# Altium schematic sheet SDCard.SchDoc
size A4; SheetNumber: 9; SheetTotal: 22
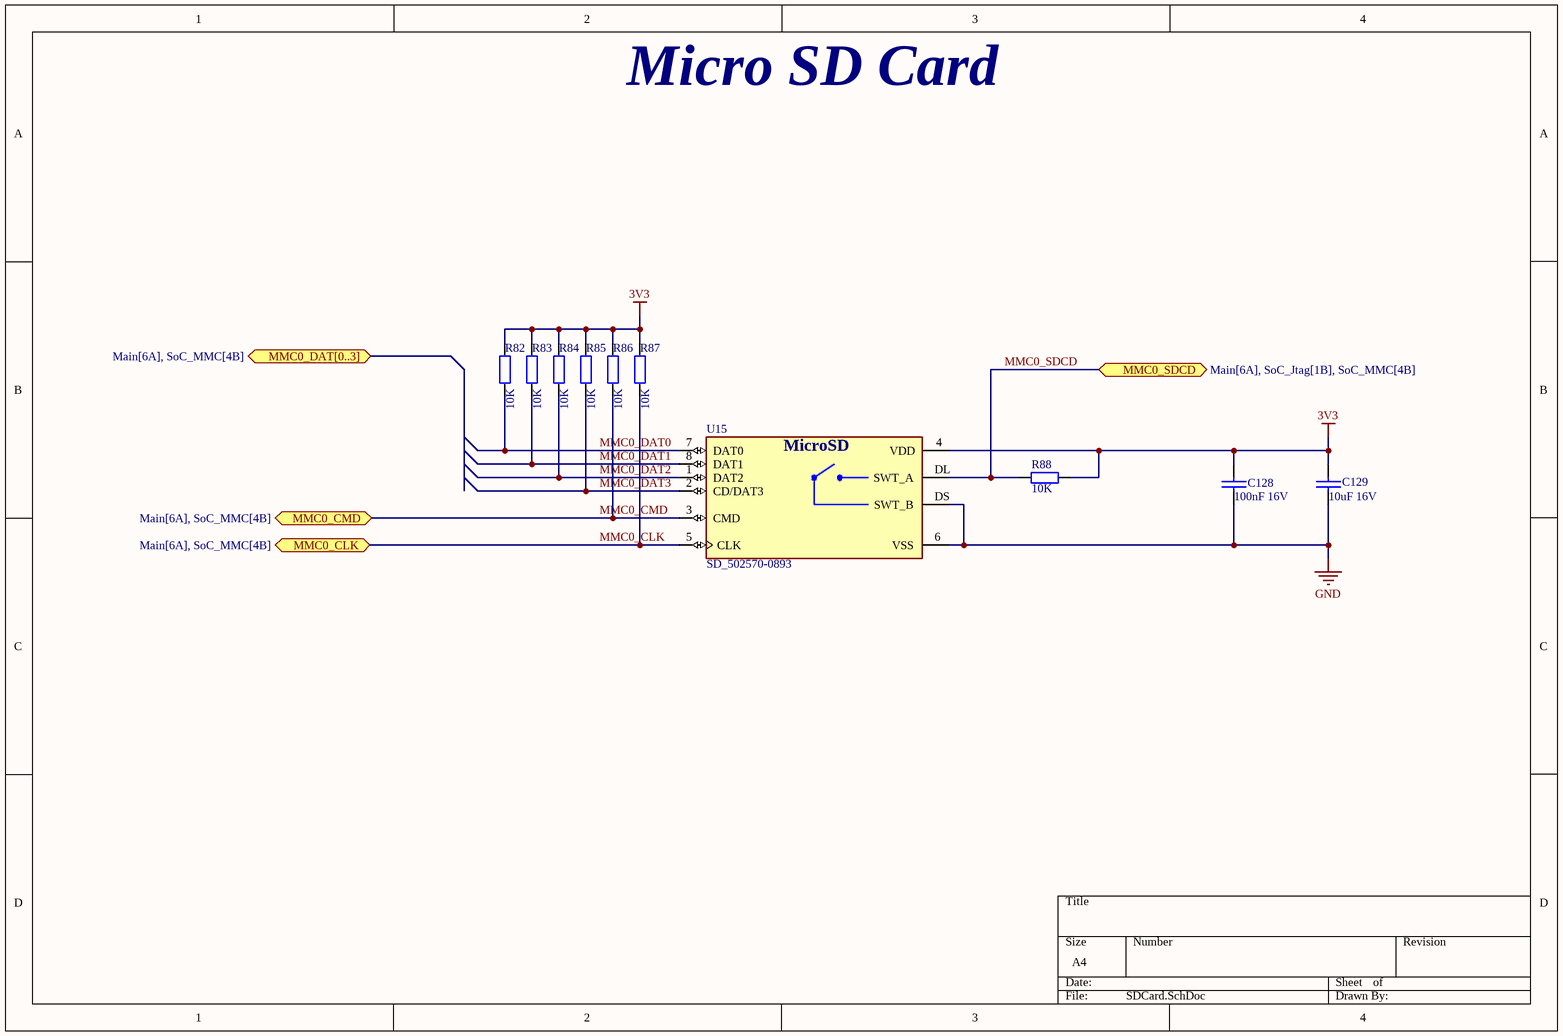
[diagram p0: SDCard.SchDoc]

## Parts
C128  100nF 16V  [C_0402]
C129  10uF 16V  [C_0603]
R82  10K  [R_0402]
R83  10K  [R_0402]
R84  10K  [R_0402]
R85  10K  [R_0402]
R86  10K  [R_0402]
R87  10K  [R_0402]
R88  10K  [R_0402]
U15  SD_502570-0893  [MOLEX_502570-0893]

## Ports
MMC0_CLK (bidir, see Main[6A], SoC_MMC[4B]), MMC0_CMD (bidir, see Main[6A], SoC_MMC[4B]), MMC0_DAT[0..3] (bidir, see Main[6A], SoC_MMC[4B]), MMC0_SDCD (bidir, see Main[6A], SoC_Jtag[1B], SoC_MMC[4B])

## Nets
3V3: C128.1 C129.1 R82.2 R83.2 R84.2 R85.2 R86.2 R87.2 R88.2 U15.4(VDD)
GND: C128.2 C129.2 U15.6(VSS) U15.DS(SWT_B)
MMC0_CLK: R87.1 U15.5(CLK) ; port MMC0_CLK
MMC0_CMD: R86.1 U15.3(CMD) ; port MMC0_CMD
MMC0_DAT0: R82.1 U15.7(DAT0)
MMC0_DAT1: R83.1 U15.8(DAT1)
MMC0_DAT2: R84.1 U15.1(DAT2)
MMC0_DAT3: R85.1 U15.2(CD/DAT3)
MMC0_SDCD: R88.1 U15.DL(SWT_A) ; port MMC0_SDCD

## Notes on the sheet
- Micro SD Card
- (in symbol SD_502570-0893) MicroSD

## Library data of the parts
C128 = C_0402: Capacitor 0402 SMD
C129 = C_0603: Capacitor 0603 SMD
R82-R88 = R_0402: Resistor 0402 SMD
U15 = SD_502570-0893: Conn IC Socket SD Memory Cd Micro 1.10mm 8Cir Norm Mnt SMT Push-Push LF | Molex Incorporated 502570-0893; Manufacturer: Molex; Manufacturer Part Number: 502570-0893; Datasheet Link: https://www.molex.com/en-us/products/part-detail/5025700893